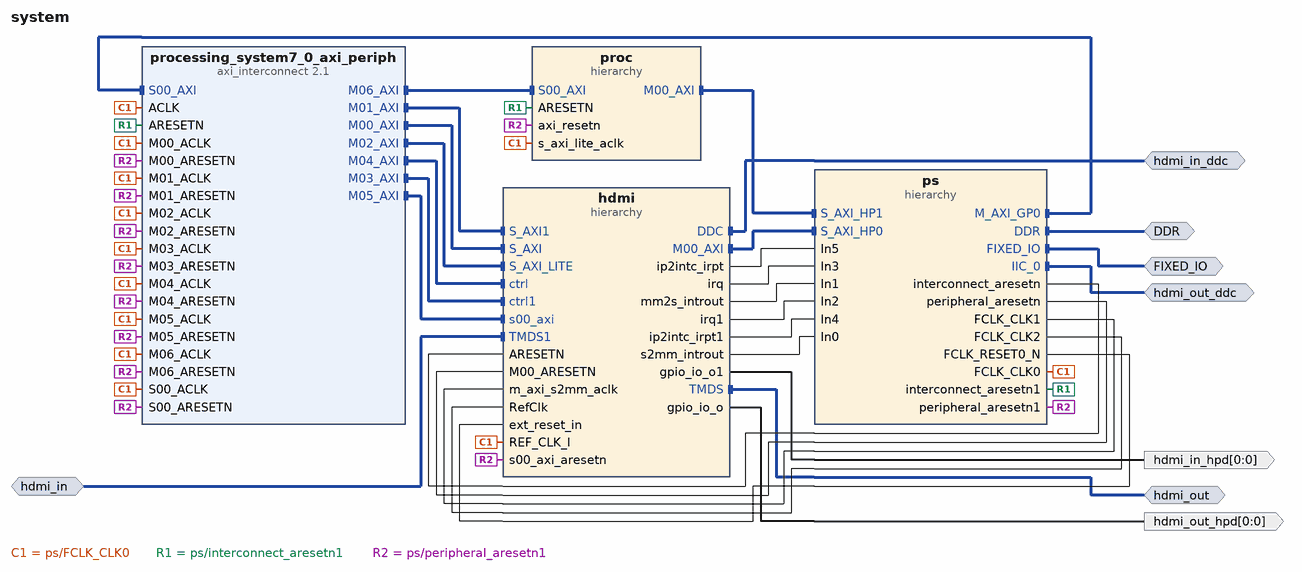
[diagram p0: block diagram of the top level]
# Vivado block design system, xc7z020clg400-1, Vivado 2017.1
create_bd_design system

create_bd_intf_port -mode Master -vlnv xilinx.com:interface:ddrx_rtl:1.0 DDR
create_bd_intf_port -mode Master -vlnv xilinx.com:display_processing_system7:fixedio_rtl:1.0 FIXED_IO
create_bd_intf_port -mode Slave -vlnv digilentinc.com:interface:tmds_rtl:1.0 hdmi_in
create_bd_intf_port -mode Master -vlnv xilinx.com:interface:iic_rtl:1.0 hdmi_in_ddc
create_bd_intf_port -mode Master -vlnv digilentinc.com:interface:tmds_rtl:1.0 hdmi_out
create_bd_intf_port -mode Master -vlnv xilinx.com:interface:iic_rtl:1.0 hdmi_out_ddc
create_bd_port -dir O -from 0 -to 0 hdmi_in_hpd
create_bd_port -dir O -from 0 -to 0 hdmi_out_hpd

create_bd_cell -type hier hdmi
create_bd_cell -type hier ps
create_bd_cell -type hier proc
create_bd_cell -type ip -vlnv xilinx.com:ip:axi_interconnect:2.1 processing_system7_0_axi_periph
set_property -dict {CONFIG.NUM_MI 7} [get_bd_cells processing_system7_0_axi_periph]

# ---- hierarchy /hdmi ----
current_bd_instance /hdmi
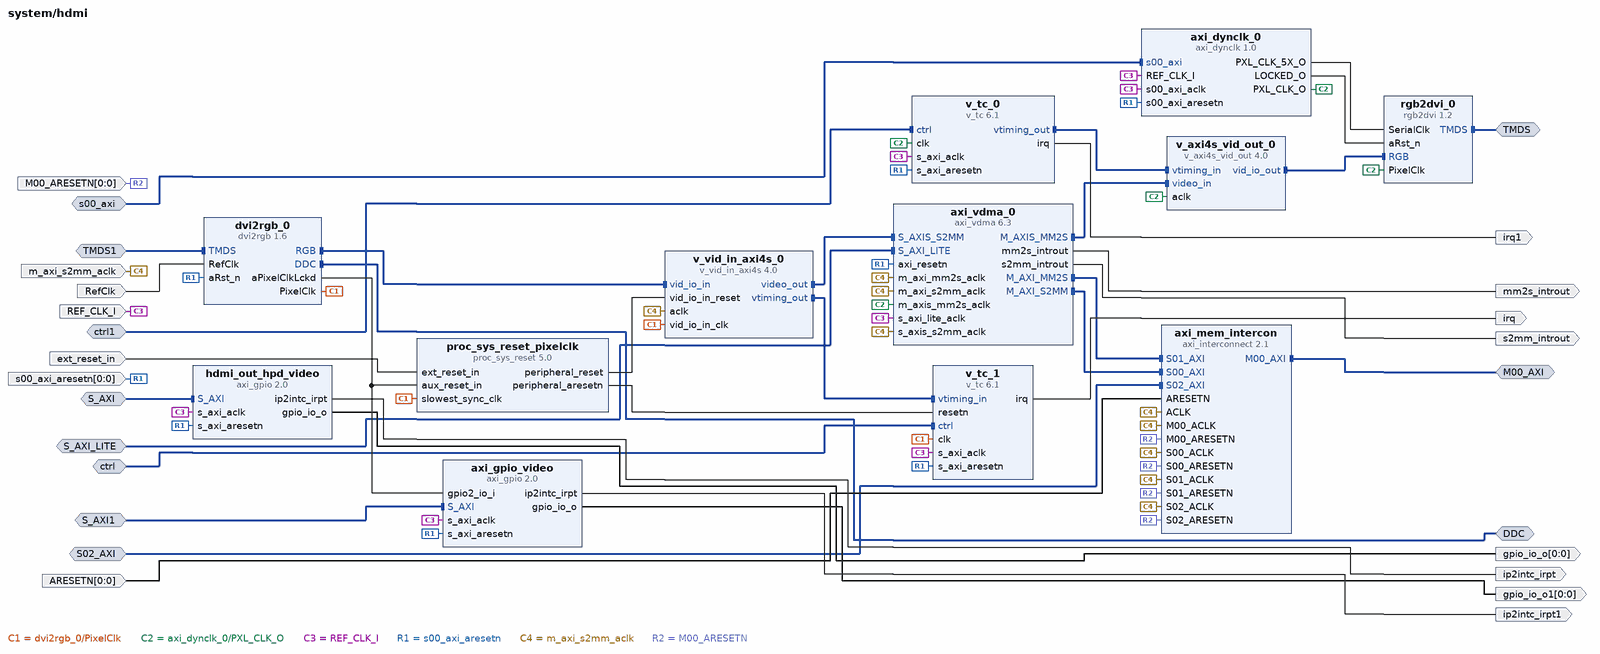
[diagram p1: block diagram inside /hdmi]
create_bd_intf_pin -mode Slave -vlnv xilinx.com:interface:aximm_rtl:1.0 ctrl
create_bd_intf_pin -mode Slave -vlnv xilinx.com:interface:aximm_rtl:1.0 S_AXI_LITE
create_bd_intf_pin -mode Slave -vlnv xilinx.com:interface:aximm_rtl:1.0 S_AXI
create_bd_intf_pin -mode Slave -vlnv xilinx.com:interface:aximm_rtl:1.0 s00_axi
create_bd_intf_pin -mode Slave -vlnv xilinx.com:interface:aximm_rtl:1.0 S_AXI1
create_bd_intf_pin -mode Master -vlnv digilentinc.com:interface:tmds_rtl:1.0 TMDS
create_bd_intf_pin -mode Slave -vlnv xilinx.com:interface:aximm_rtl:1.0 ctrl1
create_bd_intf_pin -mode Slave -vlnv digilentinc.com:interface:tmds_rtl:1.0 TMDS1
create_bd_intf_pin -mode Master -vlnv xilinx.com:interface:iic_rtl:1.0 DDC
create_bd_intf_pin -mode Master -vlnv xilinx.com:interface:aximm_rtl:1.0 M00_AXI
create_bd_intf_pin -mode Slave -vlnv xilinx.com:interface:aximm_rtl:1.0 S02_AXI
create_bd_pin -dir I -type clk REF_CLK_I
create_bd_pin -dir I -from 0 -to 0 -type rst s00_axi_aresetn
create_bd_pin -dir O -type intr irq
create_bd_pin -dir I -type rst ext_reset_in
create_bd_pin -dir I -type clk m_axi_s2mm_aclk
create_bd_pin -dir O -type intr mm2s_introut
create_bd_pin -dir O -type intr s2mm_introut
create_bd_pin -dir O -type intr ip2intc_irpt
create_bd_pin -dir O -from 0 -to 0 gpio_io_o
create_bd_pin -dir O -type intr ip2intc_irpt1
create_bd_pin -dir O -from 0 -to 0 gpio_io_o1
create_bd_pin -dir O -type intr irq1
create_bd_pin -dir I -type clk RefClk
create_bd_pin -dir I -from 0 -to 0 -type rst ARESETN
create_bd_pin -dir I -from 0 -to 0 -type rst M00_ARESETN

create_bd_cell -type ip -vlnv digilentinc.com:ip:axi_dynclk:1.0 axi_dynclk_0
create_bd_cell -type ip -vlnv digilentinc.com:ip:rgb2dvi:1.2 rgb2dvi_0
set_property -dict {CONFIG.kRstActiveHigh false CONFIG.kGenerateSerialClk false CONFIG.kClkRange 2} [get_bd_cells rgb2dvi_0]
create_bd_cell -type ip -vlnv digilentinc.com:ip:dvi2rgb:1.6 dvi2rgb_0
set_property -dict [list \
  CONFIG.kRstActiveHigh false \
  CONFIG.kClkRange 1 \
  CONFIG.kAddBUFG false \
  CONFIG.kEdidFileName 720p_edid.txt \
] [get_bd_cells dvi2rgb_0]
create_bd_cell -type ip -vlnv xilinx.com:ip:v_tc:6.1 v_tc_0
set_property -dict {CONFIG.enable_detection false} [get_bd_cells v_tc_0]
create_bd_cell -type ip -vlnv xilinx.com:ip:v_tc:6.1 v_tc_1
set_property -dict [list \
  CONFIG.HAS_INTC_IF true \
  CONFIG.max_lines_per_frame 2048 \
  CONFIG.horizontal_blank_detection false \
  CONFIG.enable_generation false \
  CONFIG.vertical_blank_detection false \
] [get_bd_cells v_tc_1]
create_bd_cell -type ip -vlnv xilinx.com:ip:proc_sys_reset:5.0 proc_sys_reset_pixelclk
create_bd_cell -type ip -vlnv xilinx.com:ip:v_axi4s_vid_out:4.0 v_axi4s_vid_out_0
set_property -dict {CONFIG.C_ADDR_WIDTH 5 CONFIG.C_VTG_MASTER_SLAVE 1} [get_bd_cells v_axi4s_vid_out_0]
create_bd_cell -type ip -vlnv xilinx.com:ip:v_vid_in_axi4s:4.0 v_vid_in_axi4s_0
set_property -dict {CONFIG.C_HAS_ASYNC_CLK 1 CONFIG.C_ADDR_WIDTH 12} [get_bd_cells v_vid_in_axi4s_0]
create_bd_cell -type ip -vlnv xilinx.com:ip:axi_gpio:2.0 axi_gpio_video
set_property -dict [list \
  CONFIG.C_GPIO_WIDTH 1 \
  CONFIG.C_GPIO2_WIDTH 1 \
  CONFIG.C_IS_DUAL 1 \
  CONFIG.C_ALL_INPUTS_2 1 \
  CONFIG.C_INTERRUPT_PRESENT 1 \
  CONFIG.C_ALL_OUTPUTS 1 \
] [get_bd_cells axi_gpio_video]
create_bd_cell -type ip -vlnv xilinx.com:ip:axi_interconnect:2.1 axi_mem_intercon
set_property -dict {CONFIG.NUM_SI 3 CONFIG.NUM_MI 1} [get_bd_cells axi_mem_intercon]
create_bd_cell -type ip -vlnv xilinx.com:ip:axi_vdma:6.3 axi_vdma_0
set_property -dict [list \
  CONFIG.c_m_axi_mm2s_data_width 32 \
  CONFIG.c_m_axis_mm2s_tdata_width 24 \
  CONFIG.c_mm2s_genlock_mode 0 \
  CONFIG.c_s2mm_genlock_mode 0 \
  CONFIG.c_mm2s_linebuffer_depth 4096 \
  CONFIG.c_s2mm_linebuffer_depth 4096 \
  CONFIG.c_mm2s_max_burst_length 32 \
  CONFIG.c_s2mm_max_burst_length 32 \
] [get_bd_cells axi_vdma_0]
create_bd_cell -type ip -vlnv xilinx.com:ip:axi_gpio:2.0 hdmi_out_hpd_video
set_property -dict {CONFIG.C_GPIO_WIDTH 1 CONFIG.C_INTERRUPT_PRESENT 1 CONFIG.C_ALL_OUTPUTS 1} [get_bd_cells hdmi_out_hpd_video]

# ---- hierarchy /ps ----
current_bd_instance /ps
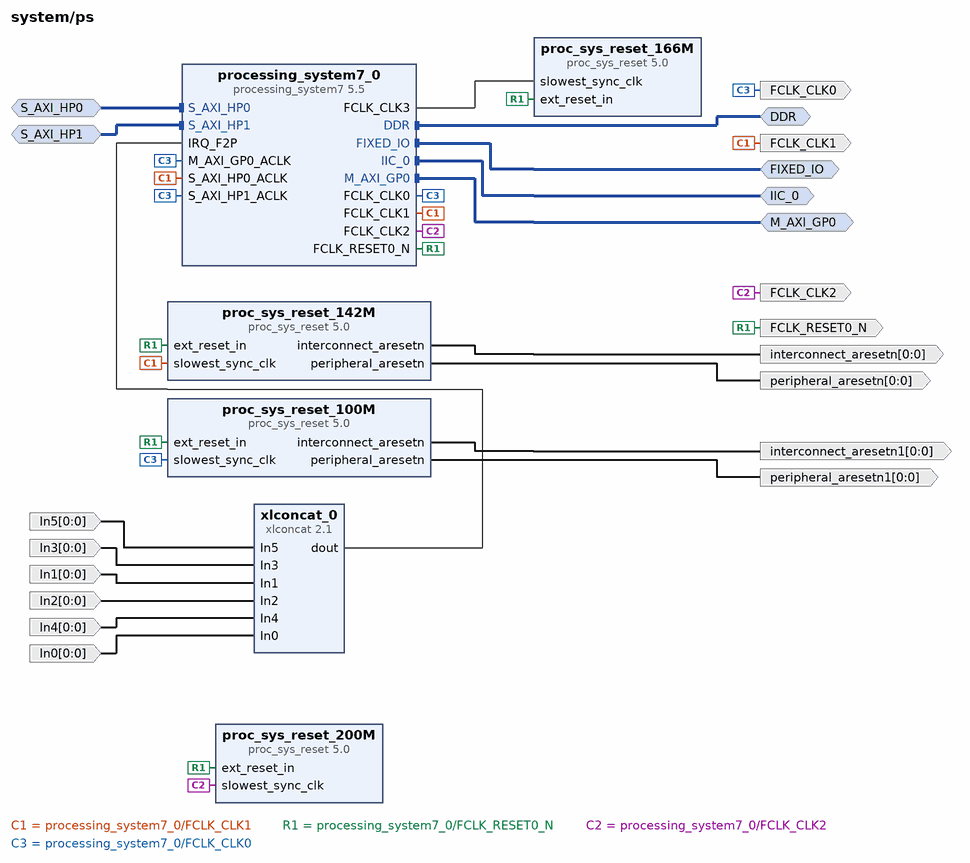
[diagram p2: block diagram inside /ps]
create_bd_intf_pin -mode Master -vlnv xilinx.com:interface:ddrx_rtl:1.0 DDR
create_bd_intf_pin -mode Master -vlnv xilinx.com:display_processing_system7:fixedio_rtl:1.0 FIXED_IO
create_bd_intf_pin -mode Master -vlnv xilinx.com:interface:iic_rtl:1.0 IIC_0
create_bd_intf_pin -mode Master -vlnv xilinx.com:interface:aximm_rtl:1.0 M_AXI_GP0
create_bd_intf_pin -mode Slave -vlnv xilinx.com:interface:aximm_rtl:1.0 S_AXI_HP0
create_bd_intf_pin -mode Slave -vlnv xilinx.com:interface:aximm_rtl:1.0 S_AXI_HP1
create_bd_pin -dir O -type clk FCLK_CLK1
create_bd_pin -dir O -type rst FCLK_RESET0_N
create_bd_pin -dir O -from 0 -to 0 -type rst interconnect_aresetn
create_bd_pin -dir O -from 0 -to 0 -type rst peripheral_aresetn
create_bd_pin -dir O -type clk FCLK_CLK2
create_bd_pin -dir O -type clk FCLK_CLK0
create_bd_pin -dir O -from 0 -to 0 -type rst interconnect_aresetn1
create_bd_pin -dir O -from 0 -to 0 -type rst peripheral_aresetn1
create_bd_pin -dir I -from 0 -to 0 In5
create_bd_pin -dir I -from 0 -to 0 In3
create_bd_pin -dir I -from 0 -to 0 In1
create_bd_pin -dir I -from 0 -to 0 In2
create_bd_pin -dir I -from 0 -to 0 In4
create_bd_pin -dir I -from 0 -to 0 In0

create_bd_cell -type ip -vlnv xilinx.com:ip:proc_sys_reset:5.0 proc_sys_reset_142M
create_bd_cell -type ip -vlnv xilinx.com:ip:proc_sys_reset:5.0 proc_sys_reset_166M
create_bd_cell -type ip -vlnv xilinx.com:ip:proc_sys_reset:5.0 proc_sys_reset_200M
create_bd_cell -type ip -vlnv xilinx.com:ip:processing_system7:5.5 processing_system7_0
set_property -dict [list \
  CONFIG.PCW_FCLK_CLK1_BUF TRUE \
  CONFIG.PCW_FCLK_CLK2_BUF TRUE \
  CONFIG.PCW_FCLK_CLK3_BUF TRUE \
  CONFIG.PCW_UIPARAM_DDR_FREQ_MHZ 525 \
  CONFIG.PCW_CRYSTAL_PERIPHERAL_FREQMHZ 50 \
  CONFIG.PCW_APU_PERIPHERAL_FREQMHZ 650 \
  CONFIG.PCW_SDIO_PERIPHERAL_FREQMHZ 50 \
  CONFIG.PCW_UART_PERIPHERAL_FREQMHZ 100 \
  CONFIG.PCW_I2C_PERIPHERAL_FREQMHZ 108.333336 \
  CONFIG.PCW_FPGA0_PERIPHERAL_FREQMHZ 100 \
  CONFIG.PCW_FPGA1_PERIPHERAL_FREQMHZ 142 \
  CONFIG.PCW_FPGA2_PERIPHERAL_FREQMHZ 200 \
  CONFIG.PCW_FPGA3_PERIPHERAL_FREQMHZ 160 \
  CONFIG.PCW_USE_S_AXI_HP0 1 \
  CONFIG.PCW_USE_S_AXI_HP1 1 \
  CONFIG.PCW_M_AXI_GP0_FREQMHZ 10 \
  CONFIG.PCW_S_AXI_HP0_FREQMHZ 10 \
  CONFIG.PCW_USE_FABRIC_INTERRUPT 1 \
  CONFIG.PCW_EN_CLK1_PORT 1 \
  CONFIG.PCW_EN_CLK2_PORT 1 \
  CONFIG.PCW_EN_CLK3_PORT 1 \
  CONFIG.PCW_IRQ_F2P_INTR 1 \
  CONFIG.PCW_PERIPHERAL_BOARD_PRESET None \
  CONFIG.PCW_PRESET_BANK1_VOLTAGE {LVCMOS 1.8V} \
  CONFIG.PCW_UIPARAM_DDR_BUS_WIDTH {16 Bit} \
  CONFIG.PCW_UIPARAM_DDR_PARTNO {MT41K128M16 JT-125} \
  CONFIG.PCW_QSPI_PERIPHERAL_ENABLE 1 \
  CONFIG.PCW_QSPI_QSPI_IO {MIO 1 .. 6} \
  CONFIG.PCW_QSPI_GRP_SINGLE_SS_ENABLE 1 \
  CONFIG.PCW_QSPI_GRP_SINGLE_SS_IO {MIO 1 .. 6} \
  CONFIG.PCW_QSPI_GRP_FBCLK_ENABLE 1 \
  CONFIG.PCW_QSPI_GRP_FBCLK_IO {MIO 8} \
  CONFIG.PCW_ENET0_PERIPHERAL_ENABLE 1 \
  CONFIG.PCW_ENET0_ENET0_IO {MIO 16 .. 27} \
  CONFIG.PCW_ENET0_GRP_MDIO_ENABLE 1 \
  CONFIG.PCW_ENET0_GRP_MDIO_IO {MIO 52 .. 53} \
  CONFIG.PCW_SD0_PERIPHERAL_ENABLE 1 \
  CONFIG.PCW_SD0_SD0_IO {MIO 40 .. 45} \
  CONFIG.PCW_SD0_GRP_CD_ENABLE 1 \
  CONFIG.PCW_SD0_GRP_CD_IO {MIO 47} \
  CONFIG.PCW_SD0_GRP_WP_ENABLE 0 \
  CONFIG.PCW_UART0_PERIPHERAL_ENABLE 1 \
  CONFIG.PCW_UART0_UART0_IO {MIO 14 .. 15} \
  CONFIG.PCW_UART1_PERIPHERAL_ENABLE 0 \
  CONFIG.PCW_USB0_PERIPHERAL_ENABLE 1 \
  CONFIG.PCW_USB0_USB0_IO {MIO 28 .. 39} \
  CONFIG.PCW_I2C0_PERIPHERAL_ENABLE 1 \
  CONFIG.PCW_I2C0_I2C0_IO EMIO \
  CONFIG.PCW_GPIO_MIO_GPIO_ENABLE 0 \
  CONFIG.PCW_FPGA_FCLK1_ENABLE 1 \
  CONFIG.PCW_FPGA_FCLK2_ENABLE 1 \
  CONFIG.PCW_FPGA_FCLK3_ENABLE 1 \
] [get_bd_cells processing_system7_0]
# 465 more settings of processing_system7_0 are not shown: defaults, MIO pin electricals, DDR timing, and values the tool derives
create_bd_cell -type ip -vlnv xilinx.com:ip:proc_sys_reset:5.0 proc_sys_reset_100M
create_bd_cell -type ip -vlnv xilinx.com:ip:xlconcat:2.1 xlconcat_0
set_property -dict {CONFIG.NUM_PORTS 6 CONFIG.dout_width 6} [get_bd_cells xlconcat_0]

# ---- hierarchy /proc ----
current_bd_instance /proc
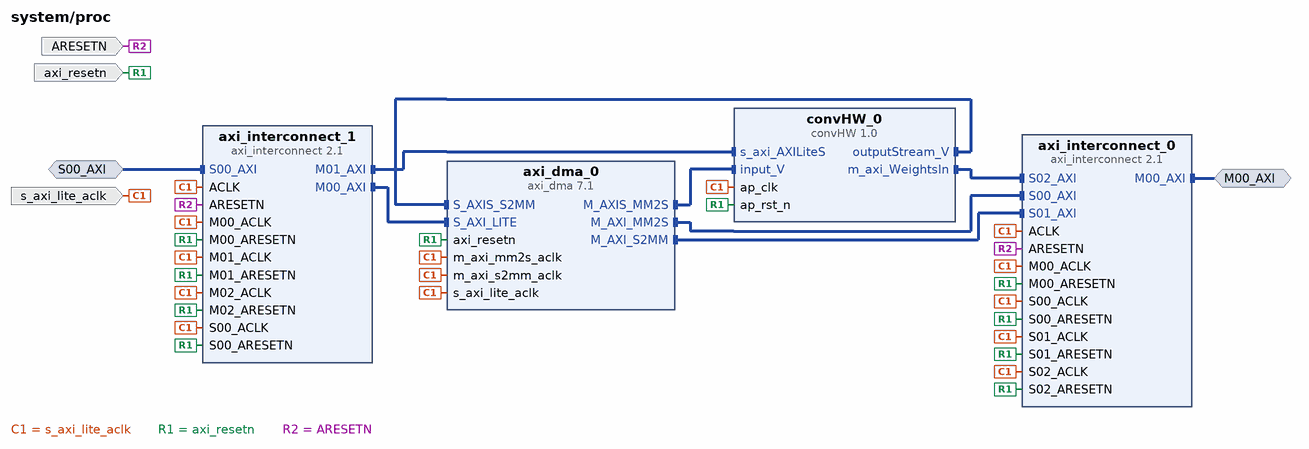
[diagram p3: block diagram inside /proc]
create_bd_intf_pin -mode Slave -vlnv xilinx.com:interface:aximm_rtl:1.0 S00_AXI
create_bd_intf_pin -mode Master -vlnv xilinx.com:interface:aximm_rtl:1.0 M00_AXI
create_bd_pin -dir I -type clk s_axi_lite_aclk
create_bd_pin -dir I -type rst axi_resetn
create_bd_pin -dir I -type rst ARESETN

create_bd_cell -type ip -vlnv xilinx.com:hls:convHW:1.0 convHW_0
create_bd_cell -type ip -vlnv xilinx.com:ip:axi_dma:7.1 axi_dma_0
set_property -dict [list \
  CONFIG.c_include_sg 0 \
  CONFIG.c_sg_length_width 23 \
  CONFIG.c_mm2s_burst_size 32 \
  CONFIG.c_include_s2mm 1 \
  CONFIG.c_s2mm_burst_size 32 \
] [get_bd_cells axi_dma_0]
create_bd_cell -type ip -vlnv xilinx.com:ip:axi_interconnect:2.1 axi_interconnect_0
set_property -dict {CONFIG.NUM_SI 3 CONFIG.NUM_MI 1} [get_bd_cells axi_interconnect_0]
create_bd_cell -type ip -vlnv xilinx.com:ip:axi_interconnect:2.1 axi_interconnect_1
set_property -dict {CONFIG.NUM_MI 3} [get_bd_cells axi_interconnect_1]

# ---- connections ----

current_bd_instance /hdmi
connect_bd_intf_net [get_bd_intf_pins v_tc_1/vtiming_in] [get_bd_intf_pins v_vid_in_axi4s_0/vtiming_out]
connect_bd_intf_net [get_bd_intf_pins axi_mem_intercon/S01_AXI] [get_bd_intf_pins axi_vdma_0/M_AXI_MM2S]
connect_bd_intf_net [get_bd_intf_pins axi_mem_intercon/S00_AXI] [get_bd_intf_pins axi_vdma_0/M_AXI_S2MM]
connect_bd_intf_net [get_bd_intf_pins axi_vdma_0/M_AXIS_MM2S] [get_bd_intf_pins v_axi4s_vid_out_0/video_in]
connect_bd_intf_net [get_bd_intf_pins axi_vdma_0/S_AXIS_S2MM] [get_bd_intf_pins v_vid_in_axi4s_0/video_out]
connect_bd_intf_net [get_bd_intf_pins dvi2rgb_0/RGB] [get_bd_intf_pins v_vid_in_axi4s_0/vid_io_in]
connect_bd_intf_net [get_bd_intf_pins rgb2dvi_0/RGB] [get_bd_intf_pins v_axi4s_vid_out_0/vid_io_out]
connect_bd_intf_net [get_bd_intf_pins v_axi4s_vid_out_0/vtiming_in] [get_bd_intf_pins v_tc_0/vtiming_out]
connect_bd_intf_net -intf_net ctrl1_1 [get_bd_intf_pins ctrl] [get_bd_intf_pins v_tc_1/ctrl]
connect_bd_intf_net [get_bd_intf_pins S_AXI_LITE] [get_bd_intf_pins axi_vdma_0/S_AXI_LITE]
connect_bd_intf_net [get_bd_intf_pins S_AXI] [get_bd_intf_pins hdmi_out_hpd_video/S_AXI]
connect_bd_intf_net [get_bd_intf_pins s00_axi] [get_bd_intf_pins axi_dynclk_0/s00_axi]
connect_bd_intf_net -intf_net S_AXI1_1 [get_bd_intf_pins S_AXI1] [get_bd_intf_pins axi_gpio_video/S_AXI]
connect_bd_intf_net -intf_net video_TMDS1 [get_bd_intf_pins TMDS] [get_bd_intf_pins rgb2dvi_0/TMDS]
connect_bd_intf_net [get_bd_intf_pins ctrl1] [get_bd_intf_pins v_tc_0/ctrl]
connect_bd_intf_net -intf_net hdmi_in_1 [get_bd_intf_pins TMDS1] [get_bd_intf_pins dvi2rgb_0/TMDS]
connect_bd_intf_net [get_bd_intf_pins DDC] [get_bd_intf_pins dvi2rgb_0/DDC]
connect_bd_intf_net [get_bd_intf_pins M00_AXI] [get_bd_intf_pins axi_mem_intercon/M00_AXI]
connect_bd_intf_net [get_bd_intf_pins S02_AXI] [get_bd_intf_pins axi_mem_intercon/S02_AXI]
connect_bd_net -net video_PixelClk [get_bd_pins dvi2rgb_0/PixelClk] \
  [get_bd_pins v_tc_1/clk] [get_bd_pins proc_sys_reset_pixelclk/slowest_sync_clk] \
  [get_bd_pins v_vid_in_axi4s_0/vid_io_in_clk]
connect_bd_net -net proc_sys_reset_0_peripheral_aresetn [get_bd_pins proc_sys_reset_pixelclk/peripheral_aresetn] [get_bd_pins v_tc_1/resetn]
connect_bd_net -net video_aPixelClkLckd [get_bd_pins dvi2rgb_0/aPixelClkLckd] \
  [get_bd_pins proc_sys_reset_pixelclk/aux_reset_in] [get_bd_pins axi_gpio_video/gpio2_io_i]
connect_bd_net -net proc_sys_reset_0_peripheral_reset [get_bd_pins proc_sys_reset_pixelclk/peripheral_reset] \
  [get_bd_pins v_vid_in_axi4s_0/vid_io_in_reset]
connect_bd_net [get_bd_pins axi_dynclk_0/PXL_CLK_O] \
  [get_bd_pins rgb2dvi_0/PixelClk] [get_bd_pins v_tc_0/clk] [get_bd_pins v_axi4s_vid_out_0/aclk] \
  [get_bd_pins axi_vdma_0/m_axis_mm2s_aclk]
connect_bd_net [get_bd_pins axi_dynclk_0/PXL_CLK_5X_O] [get_bd_pins rgb2dvi_0/SerialClk]
connect_bd_net [get_bd_pins axi_dynclk_0/LOCKED_O] [get_bd_pins rgb2dvi_0/aRst_n]
connect_bd_net -net processing_system7_0_FCLK_CLK0 [get_bd_pins REF_CLK_I] \
  [get_bd_pins axi_dynclk_0/REF_CLK_I] [get_bd_pins axi_dynclk_0/s00_axi_aclk] [get_bd_pins v_tc_0/s_axi_aclk] \
  [get_bd_pins v_tc_1/s_axi_aclk] [get_bd_pins axi_gpio_video/s_axi_aclk] [get_bd_pins axi_vdma_0/s_axi_lite_aclk] \
  [get_bd_pins hdmi_out_hpd_video/s_axi_aclk]
connect_bd_net -net rst_processing_system7_0_100M_peripheral_aresetn [get_bd_pins s00_axi_aresetn] \
  [get_bd_pins axi_dynclk_0/s00_axi_aresetn] [get_bd_pins dvi2rgb_0/aRst_n] [get_bd_pins v_tc_0/s_axi_aresetn] \
  [get_bd_pins v_tc_1/s_axi_aresetn] [get_bd_pins axi_gpio_video/s_axi_aresetn] [get_bd_pins axi_vdma_0/axi_resetn] \
  [get_bd_pins hdmi_out_hpd_video/s_axi_aresetn]
connect_bd_net -net video_irq1 [get_bd_pins v_tc_1/irq] [get_bd_pins irq]
connect_bd_net -net processing_system7_0_FCLK_RESET0_N [get_bd_pins ext_reset_in] [get_bd_pins proc_sys_reset_pixelclk/ext_reset_in]
connect_bd_net -net processing_system7_0_FCLK_CLK1 [get_bd_pins m_axi_s2mm_aclk] \
  [get_bd_pins v_vid_in_axi4s_0/aclk] [get_bd_pins axi_mem_intercon/ACLK] [get_bd_pins axi_mem_intercon/S00_ACLK] \
  [get_bd_pins axi_mem_intercon/S01_ACLK] [get_bd_pins axi_mem_intercon/S02_ACLK] [get_bd_pins axi_mem_intercon/M00_ACLK] \
  [get_bd_pins axi_vdma_0/m_axi_mm2s_aclk] [get_bd_pins axi_vdma_0/m_axi_s2mm_aclk] [get_bd_pins axi_vdma_0/s_axis_s2mm_aclk]
connect_bd_net -net video_mm2s_introut [get_bd_pins axi_vdma_0/mm2s_introut] [get_bd_pins mm2s_introut]
connect_bd_net -net video_s2mm_introut [get_bd_pins axi_vdma_0/s2mm_introut] [get_bd_pins s2mm_introut]
connect_bd_net -net video_ip2intc_irpt [get_bd_pins hdmi_out_hpd_video/ip2intc_irpt] [get_bd_pins ip2intc_irpt]
connect_bd_net [get_bd_pins hdmi_out_hpd_video/gpio_io_o] [get_bd_pins gpio_io_o]
connect_bd_net -net video_ip2intc_irpt1 [get_bd_pins axi_gpio_video/ip2intc_irpt] [get_bd_pins ip2intc_irpt1]
connect_bd_net [get_bd_pins axi_gpio_video/gpio_io_o] [get_bd_pins gpio_io_o1]
connect_bd_net -net video_irq [get_bd_pins v_tc_0/irq] [get_bd_pins irq1]
connect_bd_net -net processing_system7_0_FCLK_CLK2 [get_bd_pins RefClk] [get_bd_pins dvi2rgb_0/RefClk]
connect_bd_net -net proc_sys_reset_142M_interconnect_aresetn [get_bd_pins ARESETN] [get_bd_pins axi_mem_intercon/ARESETN]
connect_bd_net -net proc_sys_reset_142M_peripheral_aresetn [get_bd_pins M00_ARESETN] \
  [get_bd_pins axi_mem_intercon/S00_ARESETN] [get_bd_pins axi_mem_intercon/S01_ARESETN] \
  [get_bd_pins axi_mem_intercon/S02_ARESETN] [get_bd_pins axi_mem_intercon/M00_ARESETN]

current_bd_instance /ps
connect_bd_intf_net [get_bd_intf_pins DDR] [get_bd_intf_pins processing_system7_0/DDR]
connect_bd_intf_net [get_bd_intf_pins FIXED_IO] [get_bd_intf_pins processing_system7_0/FIXED_IO]
connect_bd_intf_net [get_bd_intf_pins IIC_0] [get_bd_intf_pins processing_system7_0/IIC_0]
connect_bd_intf_net [get_bd_intf_pins M_AXI_GP0] [get_bd_intf_pins processing_system7_0/M_AXI_GP0]
connect_bd_intf_net -intf_net axi_mem_intercon_M00_AXI [get_bd_intf_pins S_AXI_HP0] [get_bd_intf_pins processing_system7_0/S_AXI_HP0]
connect_bd_intf_net -intf_net S_AXI_HP1_1 [get_bd_intf_pins S_AXI_HP1] [get_bd_intf_pins processing_system7_0/S_AXI_HP1]
connect_bd_net [get_bd_pins processing_system7_0/FCLK_CLK3] [get_bd_pins proc_sys_reset_166M/slowest_sync_clk]
connect_bd_net [get_bd_pins processing_system7_0/FCLK_CLK1] \
  [get_bd_pins FCLK_CLK1] [get_bd_pins proc_sys_reset_142M/slowest_sync_clk] \
  [get_bd_pins processing_system7_0/S_AXI_HP0_ACLK]
connect_bd_net [get_bd_pins processing_system7_0/FCLK_RESET0_N] \
  [get_bd_pins FCLK_RESET0_N] [get_bd_pins proc_sys_reset_142M/ext_reset_in] [get_bd_pins proc_sys_reset_166M/ext_reset_in] \
  [get_bd_pins proc_sys_reset_200M/ext_reset_in] [get_bd_pins proc_sys_reset_100M/ext_reset_in]
connect_bd_net [get_bd_pins proc_sys_reset_142M/interconnect_aresetn] [get_bd_pins interconnect_aresetn]
connect_bd_net [get_bd_pins proc_sys_reset_142M/peripheral_aresetn] [get_bd_pins peripheral_aresetn]
connect_bd_net [get_bd_pins processing_system7_0/FCLK_CLK2] [get_bd_pins FCLK_CLK2] [get_bd_pins proc_sys_reset_200M/slowest_sync_clk]
connect_bd_net [get_bd_pins processing_system7_0/FCLK_CLK0] \
  [get_bd_pins FCLK_CLK0] [get_bd_pins processing_system7_0/M_AXI_GP0_ACLK] \
  [get_bd_pins proc_sys_reset_100M/slowest_sync_clk] [get_bd_pins processing_system7_0/S_AXI_HP1_ACLK]
connect_bd_net -net rst_processing_system7_0_100M_interconnect_aresetn [get_bd_pins proc_sys_reset_100M/interconnect_aresetn] \
  [get_bd_pins interconnect_aresetn1]
connect_bd_net -net rst_processing_system7_0_100M_peripheral_aresetn [get_bd_pins proc_sys_reset_100M/peripheral_aresetn] \
  [get_bd_pins peripheral_aresetn1]
connect_bd_net [get_bd_pins xlconcat_0/dout] [get_bd_pins processing_system7_0/IRQ_F2P]
connect_bd_net -net In5_1 [get_bd_pins In5] [get_bd_pins xlconcat_0/In5]
connect_bd_net -net In3_1 [get_bd_pins In3] [get_bd_pins xlconcat_0/In3]
connect_bd_net -net In1_1 [get_bd_pins In1] [get_bd_pins xlconcat_0/In1]
connect_bd_net -net In2_1 [get_bd_pins In2] [get_bd_pins xlconcat_0/In2]
connect_bd_net -net In4_1 [get_bd_pins In4] [get_bd_pins xlconcat_0/In4]
connect_bd_net -net In0_1 [get_bd_pins In0] [get_bd_pins xlconcat_0/In0]

current_bd_instance /proc
connect_bd_intf_net [get_bd_intf_pins axi_dma_0/M_AXI_MM2S] [get_bd_intf_pins axi_interconnect_0/S00_AXI]
connect_bd_intf_net [get_bd_intf_pins axi_dma_0/S_AXI_LITE] [get_bd_intf_pins axi_interconnect_1/M00_AXI]
connect_bd_intf_net [get_bd_intf_pins axi_dma_0/M_AXI_S2MM] [get_bd_intf_pins axi_interconnect_0/S01_AXI]
connect_bd_intf_net [get_bd_intf_pins convHW_0/m_axi_WeightsIn] [get_bd_intf_pins axi_interconnect_0/S02_AXI]
connect_bd_intf_net [get_bd_intf_pins convHW_0/outputStream_V] [get_bd_intf_pins axi_dma_0/S_AXIS_S2MM]
connect_bd_intf_net [get_bd_intf_pins convHW_0/input_V] [get_bd_intf_pins axi_dma_0/M_AXIS_MM2S]
connect_bd_intf_net [get_bd_intf_pins convHW_0/s_axi_AXILiteS] [get_bd_intf_pins axi_interconnect_1/M01_AXI]
connect_bd_intf_net [get_bd_intf_pins S00_AXI] [get_bd_intf_pins axi_interconnect_1/S00_AXI]
connect_bd_intf_net [get_bd_intf_pins M00_AXI] [get_bd_intf_pins axi_interconnect_0/M00_AXI]
connect_bd_net [get_bd_pins s_axi_lite_aclk] \
  [get_bd_pins convHW_0/ap_clk] [get_bd_pins axi_dma_0/s_axi_lite_aclk] [get_bd_pins axi_dma_0/m_axi_mm2s_aclk] \
  [get_bd_pins axi_dma_0/m_axi_s2mm_aclk] [get_bd_pins axi_interconnect_0/ACLK] [get_bd_pins axi_interconnect_0/S00_ACLK] \
  [get_bd_pins axi_interconnect_0/S01_ACLK] [get_bd_pins axi_interconnect_0/S02_ACLK] \
  [get_bd_pins axi_interconnect_0/M00_ACLK] [get_bd_pins axi_interconnect_1/ACLK] [get_bd_pins axi_interconnect_1/S00_ACLK] \
  [get_bd_pins axi_interconnect_1/M00_ACLK] [get_bd_pins axi_interconnect_1/M01_ACLK] \
  [get_bd_pins axi_interconnect_1/M02_ACLK]
connect_bd_net [get_bd_pins axi_resetn] \
  [get_bd_pins convHW_0/ap_rst_n] [get_bd_pins axi_dma_0/axi_resetn] [get_bd_pins axi_interconnect_0/S00_ARESETN] \
  [get_bd_pins axi_interconnect_0/S01_ARESETN] [get_bd_pins axi_interconnect_0/S02_ARESETN] \
  [get_bd_pins axi_interconnect_0/M00_ARESETN] [get_bd_pins axi_interconnect_1/S00_ARESETN] \
  [get_bd_pins axi_interconnect_1/M00_ARESETN] [get_bd_pins axi_interconnect_1/M01_ARESETN] \
  [get_bd_pins axi_interconnect_1/M02_ARESETN]
connect_bd_net [get_bd_pins ARESETN] [get_bd_pins axi_interconnect_0/ARESETN] [get_bd_pins axi_interconnect_1/ARESETN]

current_bd_instance /
connect_bd_intf_net -intf_net S_AXI1_1 [get_bd_intf_pins hdmi/S_AXI1] [get_bd_intf_pins processing_system7_0_axi_periph/M01_AXI]
connect_bd_intf_net [get_bd_intf_pins hdmi/S_AXI] [get_bd_intf_pins processing_system7_0_axi_periph/M00_AXI]
connect_bd_intf_net [get_bd_intf_pins hdmi/S_AXI_LITE] [get_bd_intf_pins processing_system7_0_axi_periph/M02_AXI]
connect_bd_intf_net -intf_net axi_mem_intercon_M00_AXI [get_bd_intf_pins hdmi/M00_AXI] [get_bd_intf_pins ps/S_AXI_HP0]
connect_bd_intf_net -intf_net ctrl1_1 [get_bd_intf_pins processing_system7_0_axi_periph/M04_AXI] [get_bd_intf_pins hdmi/ctrl]
connect_bd_intf_net [get_bd_intf_pins processing_system7_0_axi_periph/M03_AXI] [get_bd_intf_pins hdmi/ctrl1]
connect_bd_intf_net -intf_net processing_system7_0_M_AXI_GP0 [get_bd_intf_pins ps/M_AXI_GP0] [get_bd_intf_pins processing_system7_0_axi_periph/S00_AXI]
connect_bd_intf_net [get_bd_intf_pins hdmi/s00_axi] [get_bd_intf_pins processing_system7_0_axi_periph/M05_AXI]
connect_bd_intf_net [get_bd_intf_pins proc/S00_AXI] [get_bd_intf_pins processing_system7_0_axi_periph/M06_AXI]
connect_bd_intf_net -intf_net S_AXI_ACP_1 [get_bd_intf_pins ps/S_AXI_HP1] [get_bd_intf_pins proc/M00_AXI]
connect_bd_intf_net -intf_net processing_system7_0_DDR [get_bd_intf_ports DDR] [get_bd_intf_pins ps/DDR]
connect_bd_intf_net -intf_net processing_system7_0_FIXED_IO [get_bd_intf_ports FIXED_IO] [get_bd_intf_pins ps/FIXED_IO]
connect_bd_intf_net [get_bd_intf_ports hdmi_in] [get_bd_intf_pins hdmi/TMDS1]
connect_bd_intf_net -intf_net dvi2rgb_0_DDC [get_bd_intf_ports hdmi_in_ddc] [get_bd_intf_pins hdmi/DDC]
connect_bd_intf_net -intf_net video_TMDS1 [get_bd_intf_ports hdmi_out] [get_bd_intf_pins hdmi/TMDS]
connect_bd_intf_net -intf_net processing_system7_0_IIC_0 [get_bd_intf_ports hdmi_out_ddc] [get_bd_intf_pins ps/IIC_0]
connect_bd_net -net axi_gpio_video_gpio_io_o [get_bd_pins hdmi/gpio_io_o1] [get_bd_ports hdmi_in_hpd]
connect_bd_net -net hdmi_out_hpd_video_gpio_io_o [get_bd_pins hdmi/gpio_io_o] [get_bd_ports hdmi_out_hpd]
connect_bd_net -net proc_sys_reset_142M_interconnect_aresetn [get_bd_pins ps/interconnect_aresetn] [get_bd_pins hdmi/ARESETN]
connect_bd_net -net proc_sys_reset_142M_peripheral_aresetn [get_bd_pins ps/peripheral_aresetn] [get_bd_pins hdmi/M00_ARESETN]
connect_bd_net -net processing_system7_0_FCLK_CLK0 [get_bd_pins ps/FCLK_CLK0] \
  [get_bd_pins hdmi/REF_CLK_I] [get_bd_pins proc/s_axi_lite_aclk] [get_bd_pins processing_system7_0_axi_periph/ACLK] \
  [get_bd_pins processing_system7_0_axi_periph/S00_ACLK] [get_bd_pins processing_system7_0_axi_periph/M00_ACLK] \
  [get_bd_pins processing_system7_0_axi_periph/M01_ACLK] [get_bd_pins processing_system7_0_axi_periph/M02_ACLK] \
  [get_bd_pins processing_system7_0_axi_periph/M03_ACLK] [get_bd_pins processing_system7_0_axi_periph/M04_ACLK] \
  [get_bd_pins processing_system7_0_axi_periph/M05_ACLK] [get_bd_pins processing_system7_0_axi_periph/M06_ACLK]
connect_bd_net -net processing_system7_0_FCLK_CLK1 [get_bd_pins ps/FCLK_CLK1] [get_bd_pins hdmi/m_axi_s2mm_aclk]
connect_bd_net -net processing_system7_0_FCLK_CLK2 [get_bd_pins ps/FCLK_CLK2] [get_bd_pins hdmi/RefClk]
connect_bd_net -net processing_system7_0_FCLK_RESET0_N [get_bd_pins ps/FCLK_RESET0_N] [get_bd_pins hdmi/ext_reset_in]
connect_bd_net -net rst_processing_system7_0_100M_interconnect_aresetn [get_bd_pins ps/interconnect_aresetn1] \
  [get_bd_pins proc/ARESETN] [get_bd_pins processing_system7_0_axi_periph/ARESETN]
connect_bd_net -net rst_processing_system7_0_100M_peripheral_aresetn [get_bd_pins ps/peripheral_aresetn1] \
  [get_bd_pins hdmi/s00_axi_aresetn] [get_bd_pins proc/axi_resetn] [get_bd_pins processing_system7_0_axi_periph/S00_ARESETN] \
  [get_bd_pins processing_system7_0_axi_periph/M00_ARESETN] [get_bd_pins processing_system7_0_axi_periph/M01_ARESETN] \
  [get_bd_pins processing_system7_0_axi_periph/M02_ARESETN] [get_bd_pins processing_system7_0_axi_periph/M03_ARESETN] \
  [get_bd_pins processing_system7_0_axi_periph/M04_ARESETN] [get_bd_pins processing_system7_0_axi_periph/M05_ARESETN] \
  [get_bd_pins processing_system7_0_axi_periph/M06_ARESETN]
connect_bd_net [get_bd_pins hdmi/ip2intc_irpt] [get_bd_pins ps/In5]
connect_bd_net [get_bd_pins hdmi/irq] [get_bd_pins ps/In3]
connect_bd_net [get_bd_pins hdmi/mm2s_introut] [get_bd_pins ps/In1]
connect_bd_net [get_bd_pins hdmi/irq1] [get_bd_pins ps/In2]
connect_bd_net [get_bd_pins hdmi/ip2intc_irpt1] [get_bd_pins ps/In4]
connect_bd_net [get_bd_pins hdmi/s2mm_introut] [get_bd_pins ps/In0]

# ---- address map ----
assign_bd_address -offset 0x00000000 -range 512M -target_address_space [get_bd_addr_spaces hdmi/axi_vdma_0/Data_MM2S] [get_bd_addr_segs ps/processing_system7_0/S_AXI_HP0/HP0_DDR_LOWOCM]
assign_bd_address -offset 0x00000000 -range 512M -target_address_space [get_bd_addr_spaces hdmi/axi_vdma_0/Data_S2MM] [get_bd_addr_segs ps/processing_system7_0/S_AXI_HP0/HP0_DDR_LOWOCM]
assign_bd_address -offset 0x00000000 -range 512M -target_address_space [get_bd_addr_spaces proc/axi_dma_0/Data_MM2S] [get_bd_addr_segs ps/processing_system7_0/S_AXI_HP1/HP1_DDR_LOWOCM]
assign_bd_address -offset 0x00000000 -range 512M -target_address_space [get_bd_addr_spaces proc/axi_dma_0/Data_S2MM] [get_bd_addr_segs ps/processing_system7_0/S_AXI_HP1/HP1_DDR_LOWOCM]
assign_bd_address -offset 0x00000000 -range 512M -target_address_space [get_bd_addr_spaces proc/convHW_0/Data_m_axi_WeightsIn] [get_bd_addr_segs ps/processing_system7_0/S_AXI_HP1/HP1_DDR_LOWOCM]
assign_bd_address -offset 0x40400000 -range 64K -target_address_space [get_bd_addr_spaces ps/processing_system7_0/Data] [get_bd_addr_segs proc/axi_dma_0/S_AXI_LITE/Reg]
assign_bd_address -offset 0x41200000 -range 64K -target_address_space [get_bd_addr_spaces ps/processing_system7_0/Data] [get_bd_addr_segs hdmi/axi_gpio_video/S_AXI/Reg]
assign_bd_address -offset 0x41210000 -range 64K -target_address_space [get_bd_addr_spaces ps/processing_system7_0/Data] [get_bd_addr_segs hdmi/hdmi_out_hpd_video/S_AXI/Reg]
assign_bd_address -offset 0x43000000 -range 64K -target_address_space [get_bd_addr_spaces ps/processing_system7_0/Data] [get_bd_addr_segs hdmi/axi_vdma_0/S_AXI_LITE/Reg]
assign_bd_address -offset 0x43C00000 -range 64K -target_address_space [get_bd_addr_spaces ps/processing_system7_0/Data] [get_bd_addr_segs hdmi/axi_dynclk_0/s00_axi/reg0]
assign_bd_address -offset 0x43C10000 -range 64K -target_address_space [get_bd_addr_spaces ps/processing_system7_0/Data] [get_bd_addr_segs hdmi/v_tc_0/ctrl/Reg]
assign_bd_address -offset 0x43C20000 -range 64K -target_address_space [get_bd_addr_spaces ps/processing_system7_0/Data] [get_bd_addr_segs hdmi/v_tc_1/ctrl/Reg]
assign_bd_address -offset 0x43C30000 -range 64K -target_address_space [get_bd_addr_spaces ps/processing_system7_0/Data] [get_bd_addr_segs proc/convHW_0/s_axi_AXILiteS/Reg]

validate_bd_design
save_bd_design
